# EAGLE design Solar_charger (EAGLE 8.2.2)
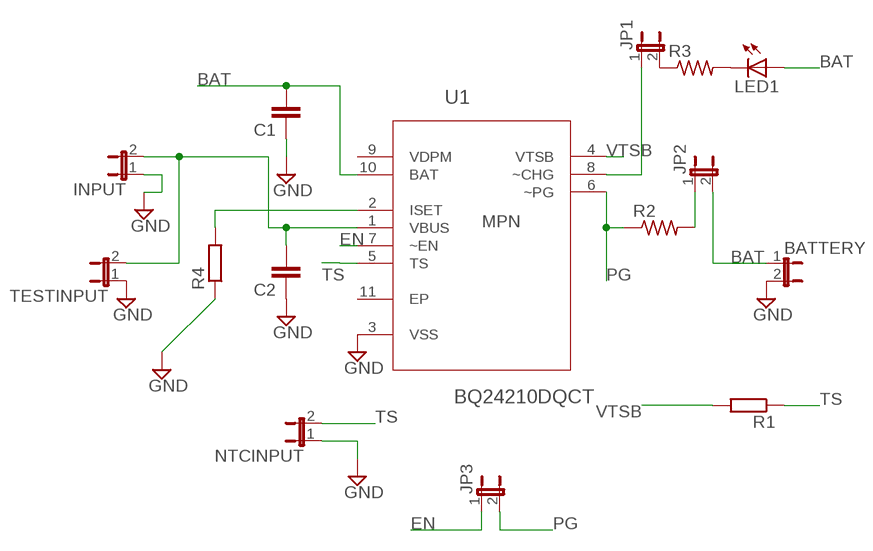
[diagram p0: schematic, sheet 1]

## Parts
BATTERY  JP1E  [JP1]
C1  C2,5-3  [C2.5-3]
C2  C2,5-3  [C2.5-3]
INPUT  JP1E  [JP1]
JP1  JP1E  [JP1]
JP2  JP1E  [JP1]
JP3  JP1E  [JP1]
LED1  LED5MM  [LED5MM]
NTCINPUT  JP1E  [JP1]
R1  R-EU_0204/7  [0204/7]
R2  R-US_M1206  [M1206]
R3  R-US_M1206  [M1206]
R4  R-EU_0204/7  [0204/7]
TESTINPUT  JP1E  [JP1]
U1  BQ24210DQCT  [SON50P200X300X80-11N]

## Nets
BAT: BATTERY.1 C1.2 JP2.2 LED1.A U1.10(BAT)
EN: JP3.1 U1.7(~EN)
GND: BATTERY.2 C1.1 C2.1 INPUT.1 NTCINPUT.1 R4.1 U1.3(VSS)
N$1: C2.2 INPUT.2 TESTINPUT.2 U1.1(VBUS)
N$2: R4.2 U1.2(ISET)
N$3: JP2.1 R2.2
N$4: LED1.K(C) R3.2
N$5: JP1.1 U1.8(~CHG)
N$6: JP1.2 R3.1
PG: JP3.2 R2.1 U1.6(~PG)
TS: NTCINPUT.2 R1.1 U1.5(TS)
VTSB: R1.2 U1.4(VTSB)
Unconnected: TESTINPUT.1 U1.9(VDPM) U1.11(EP)

## Library data of the parts
BATTERY INPUT JP1-JP3 NTCINPUT TESTINPUT = jumper:JP1E: JUMPER
C1 C2 = capacitor-wima:C: CAPACITOR naming: grid - package width
LED1 = led:LED: LED OSRAM: - CHIPLED LG R971, LG N971, LY N971, LG Q971, LY Q971, LO R971, LY R971 LH N974, LH R974 LS Q976, LO Q976, LY Q976 LO Q996 - Hyper CHIPLED LW Q18S LB Q993, LB Q99A, LB R99A - SideLED LS A670, LO A670, LY A670, LG A670, LP A670 LB A673, LV A673, LT A673, LW A673 LH A674 LY A675 LS A676, LA A676, LO A676, LY A676, LW A676 LS A679, LY A679, LG A679 - Hyper Micro SIDELED® LS Y876, LA Y876, LO Y876, LY Y876 LT Y87S - SmartLED LW L88C, LW L88S LB L89C, LB L89S, LG L890 LS L89K, LO L89K, LY L89K LS L896, LA L896, LO L896, LY L896 - TOPLED LS T670, LO T670, LY T670, LG T670, LP T670 LSG T670, LSP T670, LSY T670, LOP T670, LYG T670 LG T671, LOG T671, LSG T671 LB T673, LV T673, LT T673, LW T673 LH T674 LS T676, LA T676, LO T676, LY T676, LB T676, LH T676, LSB T676, LW T676 LB T67C, LV T67C, LT T67C, LS T67K, LO T67K, LY T67K, LW E67C LS E67B, LA E67B, LO E67B, LY E67B, LB E67C, LV E67C, LT E67C LW T67C LS T679, LY T679, LG T679 LS T770, LO T770, LY T770, LG T770, LP T770 LB T773, LV T773, LT T773, LW T773 LH T774 LS E675, LA E675, LY E675, LS T675 LS T776, LA T776, LO T776, LY T776, LB T776 LHGB T686 LT T68C, LB T68C - Hyper Mini TOPLED® LB M676 - Mini TOPLED Santana® LG M470 LS M47K, LO M47K, LY M47K Source: http://www.osram.convergy.de LUXEON: - LUMILED® LXK2-PW12-R00, LXK2-PW12-S00, LXK2-PW14-U00, LXK2-PW14-V00 LXK2-PM12-R00, LXK2-PM12-S00, LXK2-PM14-U00 LXK2-PE12-Q00, LXK2-PE12-R00, LXK2-PE12-S00, LXK2-PE14-T00, LXK2-PE14-U00 LXK2-PB12-K00, LXK2-PB12-L00, LXK2-PB12-M00, LXK2-PB14-N00, LXK2-PB14-P00, LXK2-PB14-Q00 LXK2-PR12-L00, LXK2-PR12-M00, LXK2-PR14-Q00, LXK2-PR14-R00 LXK2-PD12-Q00, LXK2-PD12-R00, LXK2-PD12-S00 LXK2-PH12-R00, LXK2-PH12-S00 LXK2-PL12-P00, LXK2-PL12-Q00, LXK2-PL12-R00 Source: www.luxeon.com KINGBRIGHT: KA-3528ASYC Source: www.kingbright.com
R1 R4 = rcl:R-EU_: RESISTOR, European symbol
R2 R3 = rcl:R-US_: RESISTOR, American symbol
U1 = Texas Instruments_By_element14_Batch_1:BQ24210DQCT: Single Cell Li-Ion Battery Solar Charger; MPN: BQ24210DQCT; OC_FARNELL: 1903633; OC_NEWARK: 56T0491; PACKAGE: SON-10; SUPPLIER: TEXAS INSTRUMENTS

## Net classes
0 default: width 0.305 mm, drill 0.508 mm, clearance 0.127 mm

## Board
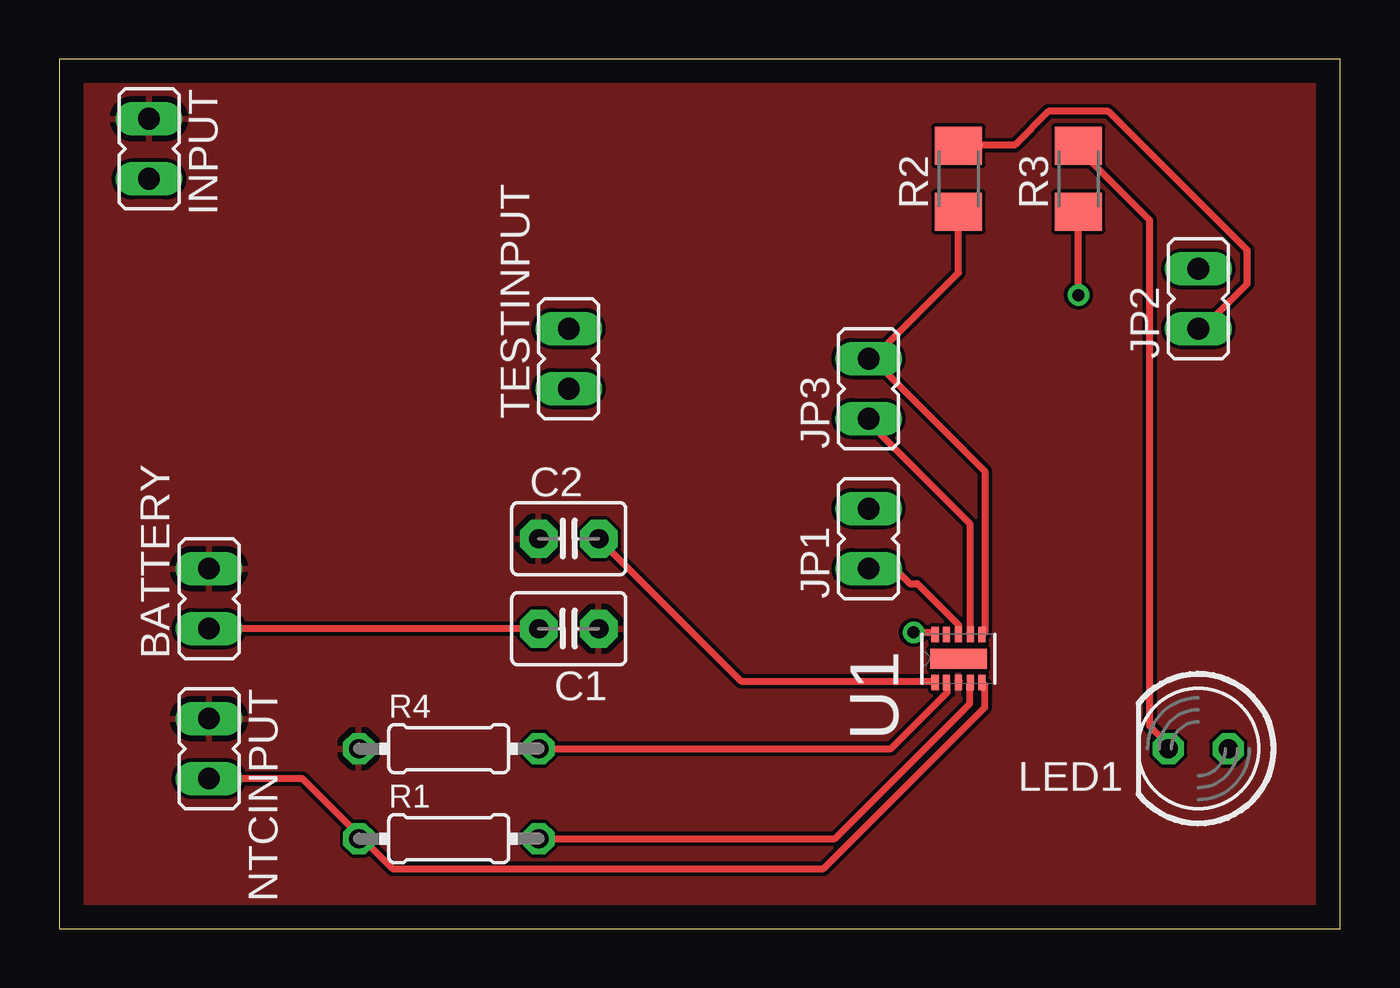
[diagram p1: board, top side]
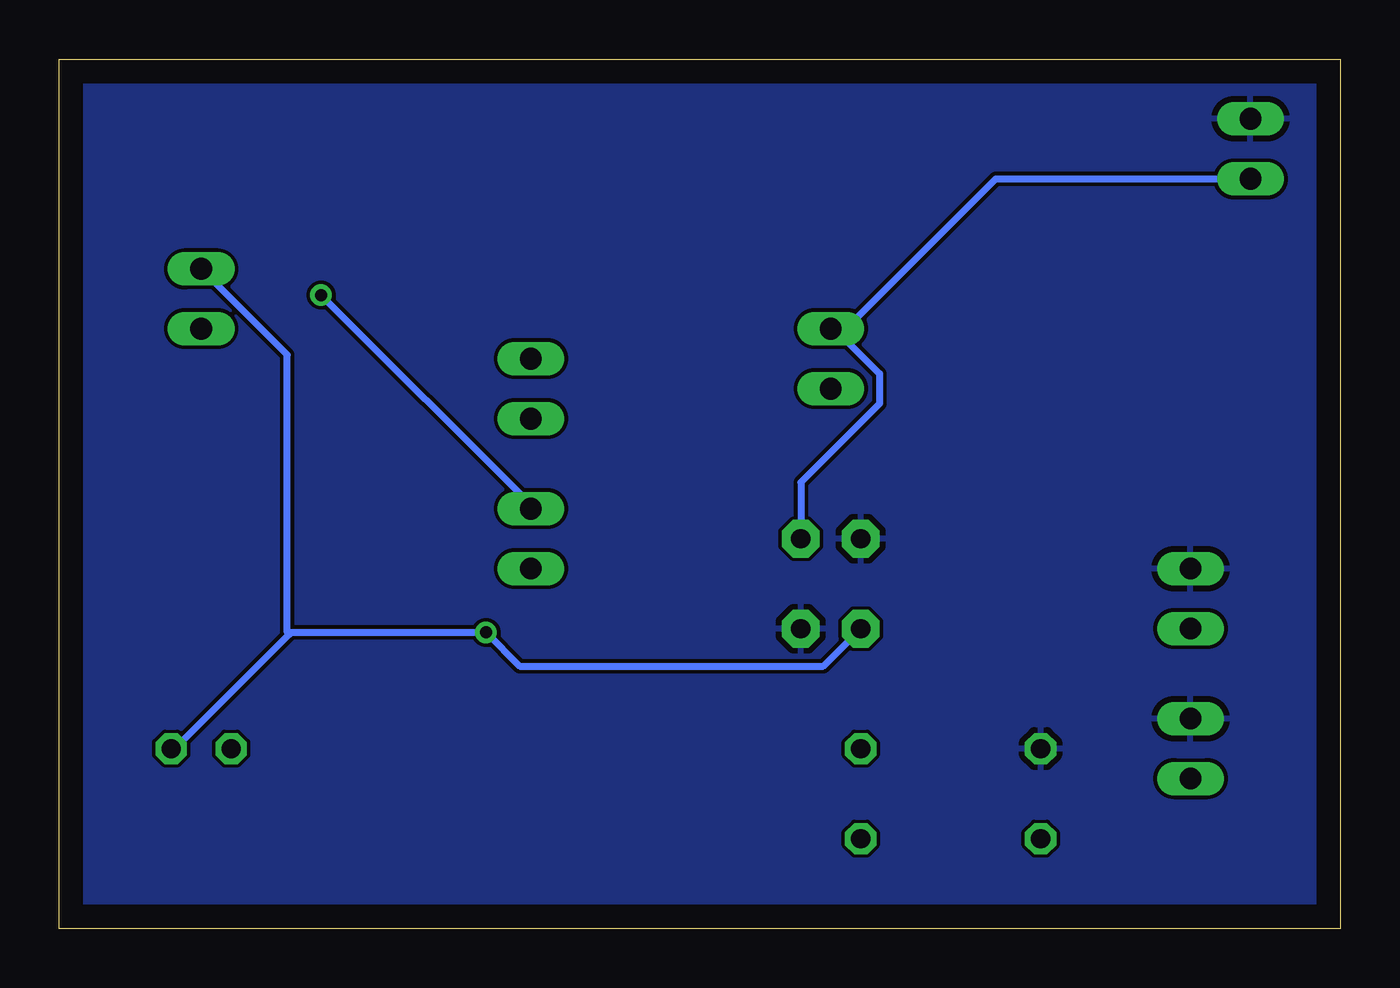
[diagram p2: board, bottom side, seen from below]

Size 54.28 x 36.82 mm. Coordinates in mm from the lower left corner, seen from the top.
Outline: 0,0 54.28,0 54.28,36.82 0,36.82 0,0
Copper layers (1*16): Top 0.035mm / dielectric 1.5mm / Bottom 0.035mm
Design rules "default": minimum track width 6mil, minimum drill 0.35mm, track to track 6mil, track to pad 6mil, pad to pad 6mil, via to via 6mil, smd to smd 6mil, copper to edge 40mil, drill to drill 6mil, minimum pad ring 10mil, minimum via ring 8mil, stop-mask expansion 4mil, vias tented up to drill 0mil, thermal gap 10mil

### Footprints (pad centres in the part's own frame; a part is rotated, then mirrored left to right if it is on the bottom)
JP1 = drill 0.914 long: 1 0,-1.27; 2 0,1.27
C2.5-3 = drill 0.813 pad 1.6 octagon: 1 -1.27,0; 2 1.27,0
LED5MM = drill 0.813 octagon: A -1.27,0; K 1.27,0
0204/7 = drill 0.813 octagon: 1 -3.81,0; 2 3.81,0
M1206 = smd 1.6 x 2: 1 -1.4,0; 2 1.4,0
SON50P200X300X80-11N = smd 0.66 x 0.305: 1 -1.016,0.991; 2 -1.016,0.508; 3 -1.016,0; 4 -1.016,-0.508; 5 -1.016,-0.991; 6 1.016,-0.991; 7 1.016,-0.508; 8 1.016,0; 9 1.016,0.508; 10 1.016,0.991 | smd 0.838 x 2.388: 11 0,0

### Placement (x,y rotation side)
BATTERY  6.35,13.97 0 top
C1  21.59,12.7 180 top
C2  21.59,16.51 0 top
INPUT  3.81,33.02 180 top
JP1  34.29,16.51 0 top
JP2  48.26,26.67 0 top
JP3  34.29,22.86 0 top
LED1  48.26,7.62 180 top
NTCINPUT  6.35,7.62 180 top
R1  16.51,3.81 0 top
R2  38.1,31.75 90 top
R3  43.18,31.75 90 top
R4  16.51,7.62 0 top
TESTINPUT  21.59,24.13 0 top
U1  38.1,11.43 90 top

### Tracks (layer width: path | path; a pad name or v marks a point on that pad's centre or on a via)
BAT  (via drill 0.51)
  Top 0.305: C1.2 BATTERY.1 | v36.2,12.54 36.99,12.54 U1.10
  Bottom 0.305: 44.53,12.46 49.37,7.62 LED1.A | 44.53,12.46 44.45,12.54 v36.2,12.54 34.77,11.11 21.91,11.11 C1.2 | JP2.2 44.61,24.29 44.61,12.54 44.53,12.46
EN
  Top 0.305: JP3.1 34.29,21.43 38.58,17.14 38.58,12.54 U1.7
GND
  pour Top: -1.27,38.1 -1.27,-2.54 55.88,-2.54 55.88,38.1
  pour Bottom: -2.54,39.37 -2.54,-1.27 -1.27,-2.54 55.88,-2.54 55.88,38.1 55.88,40.64 -1.27,40.64
N$1
  Top 0.305: C2.2 28.89,10.48 36.99,10.48 U1.1
  Bottom 0.305: INPUT.2 14.61,31.75 20.95,25.4 21.43,25.4 | C2.2 22.86,18.89 19.53,22.23 19.53,23.5 21.43,25.4 | 21.43,25.4 TESTINPUT.2
N$2
  Top 0.305: R4.2 35.24,7.62 37.62,10 37.62,10.32 U1.2
N$3
  Top 0.305: JP2.1 48.42,25.4 50.32,27.3 50.32,28.73 44.45,34.61 41.91,34.61 40.48,33.18 38.1,33.18 R2.2
N$4
  Top 0.305: LED1.K 46.99,7.78 46.2,8.57 46.2,30 43.18,33.02 R3.2
N$5
  Top 0.305: U1.8 38.1,12.86 36.35,14.61 36.04,14.61 35.4,15.24 JP1.1
N$6  (via drill 0.51)
  Top 0.305: v43.18,26.83 R3.1
  Bottom 0.305: v43.18,26.83 34.29,17.94 JP1.2
PG
  Top 0.305: 34.45,24.13 39.21,19.37 39.21,12.54 U1.6 | R2.1 38.1,27.78 34.45,24.13 | 34.45,24.13 JP3.2
TS
  Top 0.305: 12.86,3.81 14.13,2.54 32.38,2.54 39.21,9.37 39.21,10.32 U1.5 | NTCINPUT.2 10.32,6.35 12.86,3.81 | 12.86,3.81 R1.1
VTSB
  Top 0.305: R1.2 32.86,3.81 38.58,9.53 38.58,10.32 U1.4